# Altium project Hugo3D.PrjPcb
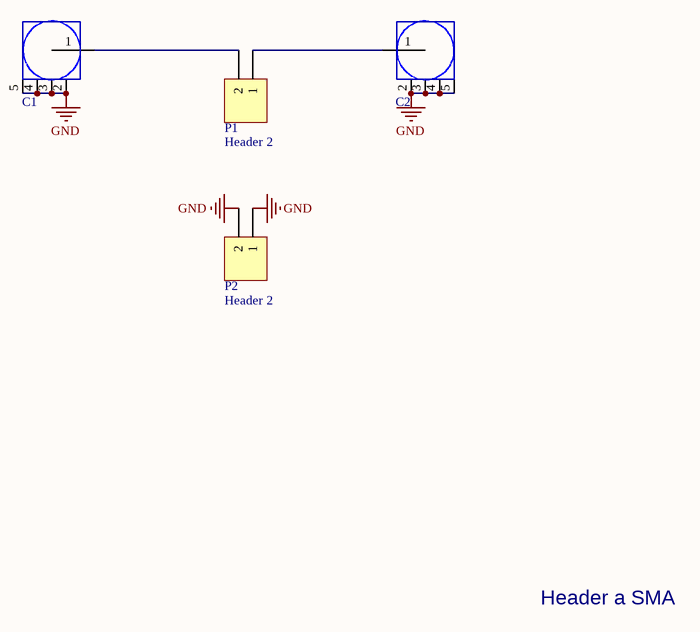
[diagram p0: Hugo3D.SchDoc]
1 sheet, 4 parts. Net scope: global (net labels, ports and power ports of the same name join across sheets).
Board file: Hugo3D.PcbDoc

## Sheet Hugo3D.SchDoc
size A4

### Parts
C1  SMA  [SMA2-pequeño]  (value not drawn)
C2  SMA  [SMA2-pequeño]  (value not drawn)
P1  Header 2  [Header2_Vertical]
P2  Header 2  [Header2_Vertical]

### Nets
GND: C1.2(GND) C1.3(GND) C1.4(GND) C1.5(GND) C2.2(GND) C2.3(GND) C2.4(GND) C2.5(GND) P2.1 P2.2
NetC1_1: C1.1(RF) P1.2
NetC2_1: C2.1(RF) P1.1

### Notes on the sheet
- Header a SMA

### Library data of the parts
P1 P2 = Header 2: Header, 2-Pin; LatestRevisionDate: 17-Jul-2002; LatestRevisionNote: Re-released for DXP Platform.; Publisher: Altium Limited